# Altium schematic sheet Sheet4.SchDoc
size A3; DocumentNumber: 4; SheetNumber: 4; SheetTotal: 7
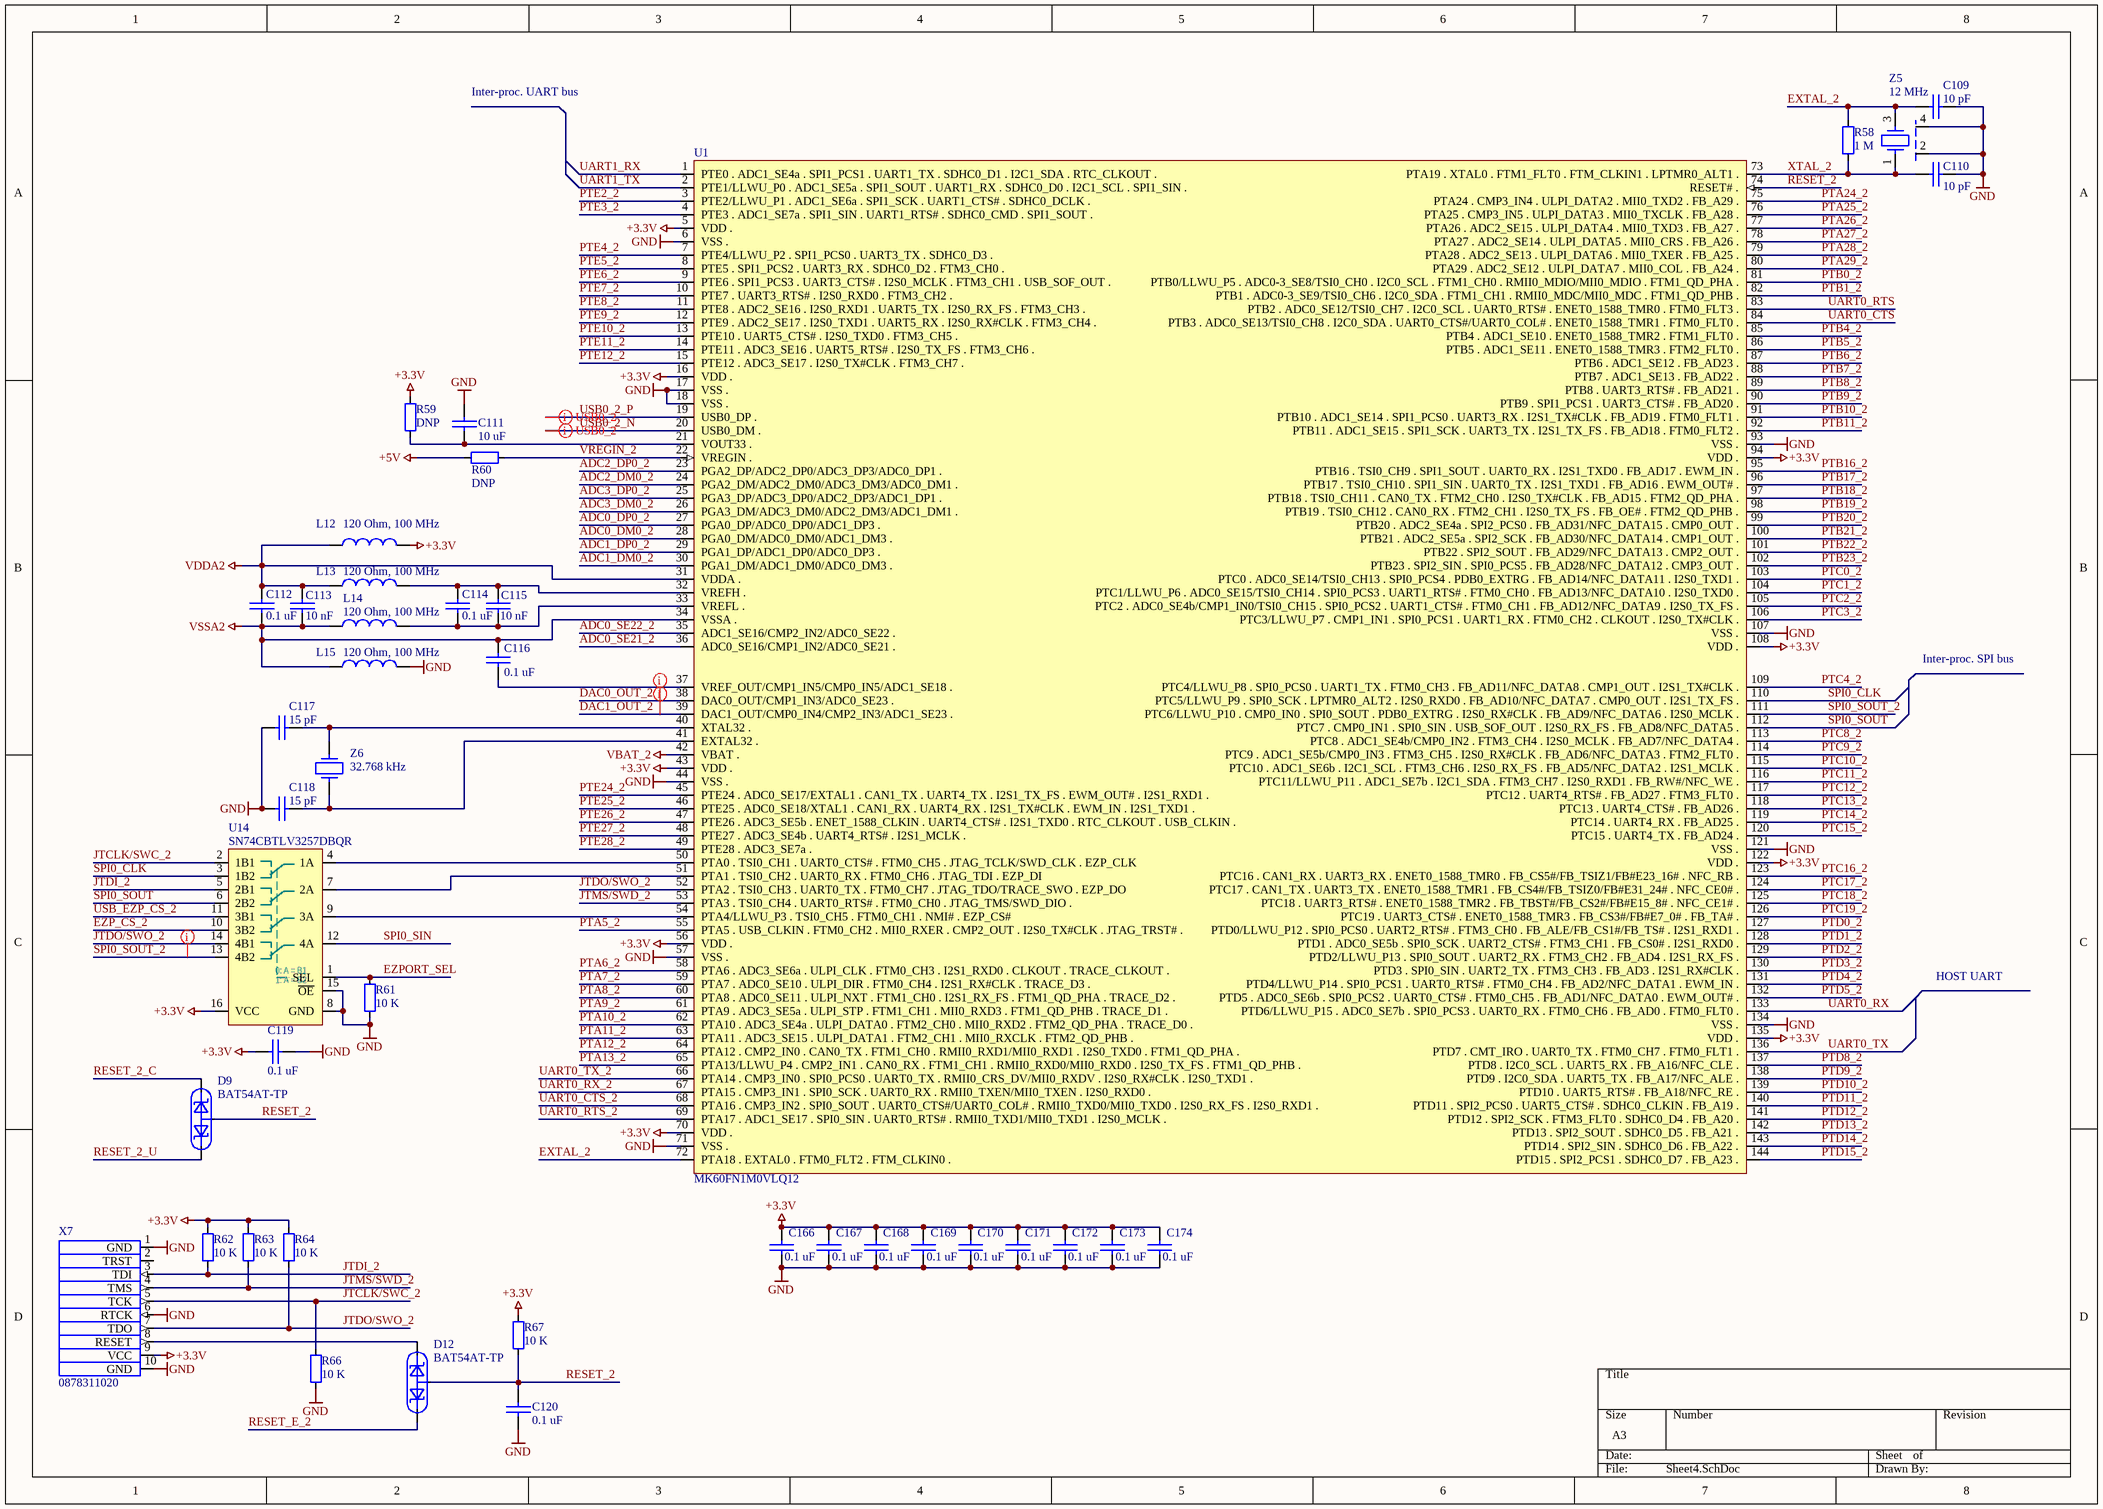
[diagram p0: Sheet4.SchDoc]

## Parts
C109  value 10 pF  [1608[0603]]  (hidden comment: CCPF010K0603)
C110  value 10 pF  [1608[0603]]  (hidden comment: CCPF010K0603)
C111  value 10 uF  [2012[0805]]  (hidden comment: C2012X5R1C106K085AC)
C112  value 0.1 uF  [1005[0402]]  (hidden comment: CL10B104KA8NNND)
C113  value 10 nF  [1005[0402]]  (hidden comment: CL05B103KB5NNNC)
C114  value 0.1 uF  [1005[0402]]  (hidden comment: CL10B104KA8NNND)
C115  value 10 nF  [1005[0402]]  (hidden comment: CL05B103KB5NNNC)
C116  value 0.1 uF  [1608[0603]]  (hidden comment: CL10B104KA8NNND)
C117  value 15 pF  [1608[0603]]  (hidden comment: CC0603JRNPO9BN150)
C118  value 15 pF  [1608[0603]]  (hidden comment: CC0603JRNPO9BN150)
C119  value 0.1 uF  [1005[0402]]  (hidden comment: CL10B104KA8NNND)
C120  value 0.1 uF  [1005[0402]]  (hidden comment: CL10B104KA8NNND)
C166  value 0.1 uF  [1005[0402]]  (hidden comment: CL10B104KA8NNND)
C167  value 0.1 uF  [1005[0402]]  (hidden comment: CL10B104KA8NNND)
C168  value 0.1 uF  [1005[0402]]  (hidden comment: CL10B104KA8NNND)
C169  value 0.1 uF  [1005[0402]]  (hidden comment: CL10B104KA8NNND)
C170  value 0.1 uF  [1005[0402]]  (hidden comment: CL10B104KA8NNND)
C171  value 0.1 uF  [1005[0402]]  (hidden comment: CL10B104KA8NNND)
C172  value 0.1 uF  [1005[0402]]  (hidden comment: CL10B104KA8NNND)
C173  value 0.1 uF  [1005[0402]]  (hidden comment: CL10B104KA8NNND)
C174  value 0.1 uF  [1005[0402]]  (hidden comment: CL10B104KA8NNND)
D9  BAT54AT-TP  [SOT-523F]
D12  BAT54AT-TP  [SOT-523F]
L12  value 120 Ohm, 100 MHz  [1005[0402]]  (hidden comment: MPZ1005S121C)
L13  value 120 Ohm, 100 MHz  [1005[0402]]  (hidden comment: MPZ1005S121C)
L14  value 120 Ohm, 100 MHz  [1005[0402]]  (hidden comment: MPZ1005S121C)
L15  value 120 Ohm, 100 MHz  [1005[0402]]  (hidden comment: MPZ1005S121C)
R58  value 1 M  [0603]  (hidden comment: RC0603FR-071ML)
R59  value DNP  [0603]  (hidden comment: DNP_0603)  (no BOM)
R60  value DNP  [0603]  (hidden comment: DNP_0603)  (no BOM)
R61  value 10 K  [0402]  (hidden comment: ERJ-3EKF1002V)
R62  value 10 K  [0402]  (hidden comment: ERJ-3EKF1002V)
R63  value 10 K  [0402]  (hidden comment: ERJ-3EKF1002V)
R64  value 10 K  [0402]  (hidden comment: ERJ-3EKF1002V)
R66  value 10 K  [0402]  (hidden comment: ERJ-3EKF1002V)
R67  value 10 K  [0402]  (hidden comment: ERJ-3EKF1002V)
U1  MK60FN1M0VLQ12  [LQFP144]
U14  SN74CBTLV3257DBQR  [TI DBQ 16pin (R-PDSO-G16)]
X7  0878311020  [878311020 MGRID WALL HDR SMD]
Z5  value 12 MHz  [DSX321G]  (hidden comment: NX3225SA-12.000MHZ-STD-CSR-1)
Z6  value 32.768 kHz  [ABS10]  (hidden comment: CM200C32768DZBT)

## Nets
+3.3V: C119.1 C166.2 C167.2 C168.2 C169.2 C170.2 C171.2 C172.2 C173.2 C174.2 L12.2 R59.1 R62.1 R63.1 R64.1 R67.1 U1.5(VDD_.) U1.16(VDD_.) U1.43(VDD_.) U1.56(VDD_.) U1.70(VDD_.) U1.94(VDD_.) U1.108(VDD_.) U1.122(VDD_.) U1.135(VDD_.) U14.16(VCC) X7.9(VCC)
+5V: R60.1
GND: C109.2 C110.2 C111.2 C117.2 C118.2 C119.2 C120.2 C166.1 C167.1 C168.1 C169.1 C170.1 C171.1 C172.1 C173.1 C174.1 L15.2 R61.2 R66.2 U1.6(VSS_.) U1.17(VSS_.) U1.18(VSS_.) U1.44(VSS_.) U1.57(VSS_.) U1.71(VSS_.) U1.93(VSS_.) U1.107(VSS_.) U1.121(VSS_.) U1.134(VSS_.) U14.8(GND) U14.15(~{OE}) X7.1(GND) X7.6(RTCK) X7.10(GND) Z5.2 Z5.4
VBAT_2: U1.42(VBAT_.)
VDDA2: C112.2 C113.1 L12.1 L13.1 U1.31(VDDA_.)
VSSA2: C112.1 C113.2 C116.2 L14.1 L15.1 U1.34(VSSA_.)
ADC0_DM0_2: U1.28(PGA0_DM/ADC0_DM0/ADC1_DM3_.)
ADC0_DP0_2: U1.27(PGA0_DP/ADC0_DP0/ADC1_DP3_.)
ADC0_SE21_2: U1.36(ADC0_SE16/CMP1_IN2/ADC0_SE21_.)
ADC0_SE22_2: U1.35(ADC1_SE16/CMP2_IN2/ADC0_SE22_.)
ADC1_DM0_2: U1.30(PGA1_DM/ADC1_DM0/ADC0_DM3_.)
ADC1_DP0_2: U1.29(PGA1_DP/ADC1_DP0/ADC0_DP3_.)
ADC2_DM0_2: U1.24(PGA2_DM/ADC2_DM0/ADC3_DM3/ADC0_DM1_.)
ADC2_DP0_2: U1.23(PGA2_DP/ADC2_DP0/ADC3_DP3/ADC0_DP1_.)
ADC3_DM0_2: U1.26(PGA3_DM/ADC3_DM0/ADC2_DM3/ADC1_DM1_.)
ADC3_DP0_2: U1.25(PGA3_DP/ADC3_DP0/ADC2_DP3/ADC1_DP1_.)
DAC0_OUT_2: U1.38(DAC0_OUT/CMP1_IN3/ADC0_SE23_.)
DAC1_OUT_2: U1.39(DAC1_OUT/CMP0_IN4/CMP2_IN3/ADC1_SE23_.)
EXTAL_2: C109.1 R58.2 U1.72(PTA18_._EXTAL0_._FTM0_FLT2_._FTM_CLKIN0_.) Z5.3
EZP_CS_2: U14.10(3B2)
EZPORT_SEL: R61.1 U14.1(SEL)
JTCLK/SWC_2: R66.1 U14.2(1B1) X7.5(TCK)
JTDI_2: R62.2 U14.5(2B1) X7.3(TDI)
JTDO/SWO_2: R64.2 U1.52(PTA2_._TSI0_CH3_._UART0_TX_._FTM0_CH7_._JTAG_TDO/TRACE_SWO_._EZP_DO) U14.14(4B1) X7.7(TDO)
JTMS/SWD_2: R63.2 U1.53(PTA3_._TSI0_CH4_._UART0_RTS#_._FTM0_CH0_._JTAG_TMS/SWD_DIO_.) X7.4(TMS)
PTA5_2: U1.55(PTA5_._USB_CLKIN_._FTM0_CH2_._MII0_RXER_._CMP2_OUT_._I2S0_TX#CLK_._JTAG_TRST#_.)
PTA6_2: U1.58(PTA6_._ADC3_SE6a_._ULPI_CLK_._FTM0_CH3_._I2S1_RXD0_._CLKOUT_._TRACE_CLKOUT_.)
PTA7_2: U1.59(PTA7_._ADC0_SE10_._ULPI_DIR_._FTM0_CH4_._I2S1_RX#CLK_._TRACE_D3_.)
PTA8_2: U1.60(PTA8_._ADC0_SE11_._ULPI_NXT_._FTM1_CH0_._I2S1_RX_FS_._FTM1_QD_PHA_._TRACE_D2_.)
PTA9_2: U1.61(PTA9_._ADC3_SE5a_._ULPI_STP_._FTM1_CH1_._MII0_RXD3_._FTM1_QD_PHB_._TRACE_D1_.)
PTA10_2: U1.62(PTA10_._ADC3_SE4a_._ULPI_DATA0_._FTM2_CH0_._MII0_RXD2_._FTM2_QD_PHA_._TRACE_D0_.)
PTA11_2: U1.63(PTA11_._ADC3_SE15_._ULPI_DATA1_._FTM2_CH1_._MII0_RXCLK_._FTM2_QD_PHB_.)
PTA12_2: U1.64(PTA12_._CMP2_IN0_._CAN0_TX_._FTM1_CH0_._RMII0_RXD1/MII0_RXD1_._I2S0_TXD0_._FTM1_QD_PHA_.)
PTA13_2: U1.65(PTA13/LLWU_P4_._CMP2_IN1_._CAN0_RX_._FTM1_CH1_._RMII0_RXD0/MII0_RXD0_._I2S0_TX_FS_._FTM1_QD_PHB_.)
PTA24_2: U1.75(PTA24_._CMP3_IN4_._ULPI_DATA2_._MII0_TXD2_._FB_A29_.)
PTA25_2: U1.76(PTA25_._CMP3_IN5_._ULPI_DATA3_._MII0_TXCLK_._FB_A28_.)
PTA26_2: U1.77(PTA26_._ADC2_SE15_._ULPI_DATA4_._MII0_TXD3_._FB_A27_.)
PTA27_2: U1.78(PTA27_._ADC2_SE14_._ULPI_DATA5_._MII0_CRS_._FB_A26_.)
PTA28_2: U1.79(PTA28_._ADC2_SE13_._ULPI_DATA6_._MII0_TXER_._FB_A25_.)
PTA29_2: U1.80(PTA29_._ADC2_SE12_._ULPI_DATA7_._MII0_COL_._FB_A24_.)
PTB0_2: U1.81(PTB0/LLWU_P5_._ADC0-3_SE8/TSI0_CH0_._I2C0_SCL_._FTM1_CH0_._RMII0_MDIO/MII0_MDIO_._FTM1_QD_PHA_.)
PTB1_2: U1.82(PTB1_._ADC0-3_SE9/TSI0_CH6_._I2C0_SDA_._FTM1_CH1_._RMII0_MDC/MII0_MDC_._FTM1_QD_PHB_.)
PTB4_2: U1.85(PTB4_._ADC1_SE10_._ENET0_1588_TMR2_._FTM1_FLT0_.)
PTB5_2: U1.86(PTB5_._ADC1_SE11_._ENET0_1588_TMR3_._FTM2_FLT0_.)
PTB6_2: U1.87(PTB6_._ADC1_SE12_._FB_AD23_.)
PTB7_2: U1.88(PTB7_._ADC1_SE13_._FB_AD22_.)
PTB8_2: U1.89(PTB8_._UART3_RTS#_._FB_AD21_.)
PTB9_2: U1.90(PTB9_._SPI1_PCS1_._UART3_CTS#_._FB_AD20_.)
PTB10_2: U1.91(PTB10_._ADC1_SE14_._SPI1_PCS0_._UART3_RX_._I2S1_TX#CLK_._FB_AD19_._FTM0_FLT1_.)
PTB11_2: U1.92(PTB11_._ADC1_SE15_._SPI1_SCK_._UART3_TX_._I2S1_TX_FS_._FB_AD18_._FTM0_FLT2_.)
PTB16_2: U1.95(PTB16_._TSI0_CH9_._SPI1_SOUT_._UART0_RX_._I2S1_TXD0_._FB_AD17_._EWM_IN_.)
PTB17_2: U1.96(PTB17_._TSI0_CH10_._SPI1_SIN_._UART0_TX_._I2S1_TXD1_._FB_AD16_._EWM_OUT#_.)
PTB18_2: U1.97(PTB18_._TSI0_CH11_._CAN0_TX_._FTM2_CH0_._I2S0_TX#CLK_._FB_AD15_._FTM2_QD_PHA_.)
PTB19_2: U1.98(PTB19_._TSI0_CH12_._CAN0_RX_._FTM2_CH1_._I2S0_TX_FS_._FB_OE#_._FTM2_QD_PHB_.)
PTB20_2: U1.99(PTB20_._ADC2_SE4a_._SPI2_PCS0_._FB_AD31/NFC_DATA15_._CMP0_OUT_.)
PTB21_2: U1.100(PTB21_._ADC2_SE5a_._SPI2_SCK_._FB_AD30/NFC_DATA14_._CMP1_OUT_.)
PTB22_2: U1.101(PTB22_._SPI2_SOUT_._FB_AD29/NFC_DATA13_._CMP2_OUT_.)
PTB23_2: U1.102(PTB23_._SPI2_SIN_._SPI0_PCS5_._FB_AD28/NFC_DATA12_._CMP3_OUT_.)
PTC0_2: U1.103(PTC0_._ADC0_SE14/TSI0_CH13_._SPI0_PCS4_._PDB0_EXTRG_._FB_AD14/NFC_DATA11_._I2S0_TXD1_.)
PTC1_2: U1.104(PTC1/LLWU_P6_._ADC0_SE15/TSI0_CH14_._SPI0_PCS3_._UART1_RTS#_._FTM0_CH0_._FB_AD13/NFC_DATA10_._I2S0_TXD0_.)
PTC2_2: U1.105(PTC2_._ADC0_SE4b/CMP1_IN0/TSI0_CH15_._SPI0_PCS2_._UART1_CTS#_._FTM0_CH1_._FB_AD12/NFC_DATA9_._I2S0_TX_FS_.)
PTC3_2: U1.106(PTC3/LLWU_P7_._CMP1_IN1_._SPI0_PCS1_._UART1_RX_._FTM0_CH2_._CLKOUT_._I2S0_TX#CLK_.)
PTC4_2: U1.109(PTC4/LLWU_P8_._SPI0_PCS0_._UART1_TX_._FTM0_CH3_._FB_AD11/NFC_DATA8_._CMP1_OUT_._I2S1_TX#CLK_.)
PTC8_2: U1.113(PTC8_._ADC1_SE4b/CMP0_IN2_._FTM3_CH4_._I2S0_MCLK_._FB_AD7/NFC_DATA4_.)
PTC9_2: U1.114(PTC9_._ADC1_SE5b/CMP0_IN3_._FTM3_CH5_._I2S0_RX#CLK_._FB_AD6/NFC_DATA3_._FTM2_FLT0_.)
PTC10_2: U1.115(PTC10_._ADC1_SE6b_._I2C1_SCL_._FTM3_CH6_._I2S0_RX_FS_._FB_AD5/NFC_DATA2_._I2S1_MCLK_.)
PTC11_2: U1.116(PTC11/LLWU_P11_._ADC1_SE7b_._I2C1_SDA_._FTM3_CH7_._I2S0_RXD1_._FB_RW#/NFC_WE_.)
PTC12_2: U1.117(PTC12_._UART4_RTS#_._FB_AD27_._FTM3_FLT0_.)
PTC13_2: U1.118(PTC13_._UART4_CTS#_._FB_AD26_.)
PTC14_2: U1.119(PTC14_._UART4_RX_._FB_AD25_.)
PTC15_2: U1.120(PTC15_._UART4_TX_._FB_AD24_.)
PTC16_2: U1.123(PTC16_._CAN1_RX_._UART3_RX_._ENET0_1588_TMR0_._FB_CS5#/FB_TSIZ1/FB#E23_16#_._NFC_RB_.)
PTC17_2: U1.124(PTC17_._CAN1_TX_._UART3_TX_._ENET0_1588_TMR1_._FB_CS4#/FB_TSIZ0/FB#E31_24#_._NFC_CE0#_.)
PTC18_2: U1.125(PTC18_._UART3_RTS#_._ENET0_1588_TMR2_._FB_TBST#/FB_CS2#/FB#E15_8#_._NFC_CE1#_.)
PTC19_2: U1.126(PTC19_._UART3_CTS#_._ENET0_1588_TMR3_._FB_CS3#/FB#E7_0#_._FB_TA#_.)
PTD0_2: U1.127(PTD0/LLWU_P12_._SPI0_PCS0_._UART2_RTS#_._FTM3_CH0_._FB_ALE/FB_CS1#/FB_TS#_._I2S1_RXD1_.)
PTD1_2: U1.128(PTD1_._ADC0_SE5b_._SPI0_SCK_._UART2_CTS#_._FTM3_CH1_._FB_CS0#_._I2S1_RXD0_.)
PTD2_2: U1.129(PTD2/LLWU_P13_._SPI0_SOUT_._UART2_RX_._FTM3_CH2_._FB_AD4_._I2S1_RX_FS_.)
PTD3_2: U1.130(PTD3_._SPI0_SIN_._UART2_TX_._FTM3_CH3_._FB_AD3_._I2S1_RX#CLK_.)
PTD4_2: U1.131(PTD4/LLWU_P14_._SPI0_PCS1_._UART0_RTS#_._FTM0_CH4_._FB_AD2/NFC_DATA1_._EWM_IN_.)
PTD5_2: U1.132(PTD5_._ADC0_SE6b_._SPI0_PCS2_._UART0_CTS#_._FTM0_CH5_._FB_AD1/NFC_DATA0_._EWM_OUT#_.)
PTD8_2: U1.137(PTD8_._I2C0_SCL_._UART5_RX_._FB_A16/NFC_CLE_.)
PTD9_2: U1.138(PTD9_._I2C0_SDA_._UART5_TX_._FB_A17/NFC_ALE_.)
PTD10_2: U1.139(PTD10_._UART5_RTS#_._FB_A18/NFC_RE_.)
PTD11_2: U1.140(PTD11_._SPI2_PCS0_._UART5_CTS#_._SDHC0_CLKIN_._FB_A19_.)
PTD12_2: U1.141(PTD12_._SPI2_SCK_._FTM3_FLT0_._SDHC0_D4_._FB_A20_.)
PTD13_2: U1.142(PTD13_._SPI2_SOUT_._SDHC0_D5_._FB_A21_.)
PTD14_2: U1.143(PTD14_._SPI2_SIN_._SDHC0_D6_._FB_A22_.)
PTD15_2: U1.144(PTD15_._SPI2_PCS1_._SDHC0_D7_._FB_A23_.)
PTE2_2: U1.3(PTE2/LLWU_P1_._ADC1_SE6a_._SPI1_SCK_._UART1_CTS#_._SDHC0_DCLK_.)
PTE3_2: U1.4(PTE3_._ADC1_SE7a_._SPI1_SIN_._UART1_RTS#_._SDHC0_CMD_._SPI1_SOUT_.)
PTE4_2: U1.7(PTE4/LLWU_P2_._SPI1_PCS0_._UART3_TX_._SDHC0_D3_.)
PTE5_2: U1.8(PTE5_._SPI1_PCS2_._UART3_RX_._SDHC0_D2_._FTM3_CH0_.)
PTE6_2: U1.9(PTE6_._SPI1_PCS3_._UART3_CTS#_._I2S0_MCLK_._FTM3_CH1_._USB_SOF_OUT_.)
PTE7_2: U1.10(PTE7_._UART3_RTS#_._I2S0_RXD0_._FTM3_CH2_.)
PTE8_2: U1.11(PTE8_._ADC2_SE16_._I2S0_RXD1_._UART5_TX_._I2S0_RX_FS_._FTM3_CH3_.)
PTE9_2: U1.12(PTE9_._ADC2_SE17_._I2S0_TXD1_._UART5_RX_._I2S0_RX#CLK_._FTM3_CH4_.)
PTE10_2: U1.13(PTE10_._UART5_CTS#_._I2S0_TXD0_._FTM3_CH5_.)
PTE11_2: U1.14(PTE11_._ADC3_SE16_._UART5_RTS#_._I2S0_TX_FS_._FTM3_CH6_.)
PTE12_2: U1.15(PTE12_._ADC3_SE17_._I2S0_TX#CLK_._FTM3_CH7_.)
PTE24_2: U1.45(PTE24_._ADC0_SE17/EXTAL1_._CAN1_TX_._UART4_TX_._I2S1_TX_FS_._EWM_OUT#_._I2S1_RXD1_.)
PTE25_2: U1.46(PTE25_._ADC0_SE18/XTAL1_._CAN1_RX_._UART4_RX_._I2S1_TX#CLK_._EWM_IN_._I2S1_TXD1_.)
PTE26_2: U1.47(PTE26_._ADC3_SE5b_._ENET_1588_CLKIN_._UART4_CTS#_._I2S1_TXD0_._RTC_CLKOUT_._USB_CLKIN_.)
PTE27_2: U1.48(PTE27_._ADC3_SE4b_._UART4_RTS#_._I2S1_MCLK_.)
PTE28_2: U1.49(PTE28_._ADC3_SE7a_.)
RESET_2: C120.1 D9.3 D12.3 R67.2 U1.74(RESET#_.)
RESET_2_C: D9.1
RESET_2_U: D9.2
RESET_E_2: D12.2
SPI0_CLK: U1.110(PTC5/LLWU_P9_._SPI0_SCK_._LPTMR0_ALT2_._I2S0_RXD0_._FB_AD10/NFC_DATA7_._CMP0_OUT_._I2S1_TX_FS_.) U14.3(1B2)
SPI0_SIN: U14.12(4A)
SPI0_SOUT: U1.112(PTC7_._CMP0_IN1_._SPI0_SIN_._USB_SOF_OUT_._I2S0_RX_FS_._FB_AD8/NFC_DATA5_.) U14.6(2B2)
SPI0_SOUT_2: U1.111(PTC6/LLWU_P10_._CMP0_IN0_._SPI0_SOUT_._PDB0_EXTRG_._I2S0_RX#CLK_._FB_AD9/NFC_DATA6_._I2S0_MCLK_.) U14.13(4B2)
UART0_CTS: U1.84(PTB3_._ADC0_SE13/TSI0_CH8_._I2C0_SDA_._UART0_CTS#/UART0_COL#_._ENET0_1588_TMR1_._FTM0_FLT0_.)
UART0_CTS_2: U1.68(PTA16_._CMP3_IN2_._SPI0_SOUT_._UART0_CTS#/UART0_COL#_._RMII0_TXD0/MII0_TXD0_._I2S0_RX_FS_._I2S0_RXD1_.)
UART0_RTS: U1.83(PTB2_._ADC0_SE12/TSI0_CH7_._I2C0_SCL_._UART0_RTS#_._ENET0_1588_TMR0_._FTM0_FLT3_.)
UART0_RTS_2: U1.69(PTA17_._ADC1_SE17_._SPI0_SIN_._UART0_RTS#_._RMII0_TXD1/MII0_TXD1_._I2S0_MCLK_.)
UART0_RX: U1.133(PTD6/LLWU_P15_._ADC0_SE7b_._SPI0_PCS3_._UART0_RX_._FTM0_CH6_._FB_AD0_._FTM0_FLT0_.)
UART0_RX_2: U1.67(PTA15_._CMP3_IN1_._SPI0_SCK_._UART0_RX_._RMII0_TXEN/MII0_TXEN_._I2S0_RXD0_.)
UART0_TX: U1.136(PTD7_._CMT_IRO_._UART0_TX_._FTM0_CH7_._FTM0_FLT1_.)
UART0_TX_2: U1.66(PTA14_._CMP3_IN0_._SPI0_PCS0_._UART0_TX_._RMII0_CRS_DV/MII0_RXDV_._I2S0_RX#CLK_._I2S0_TXD1_.)
UART1_RX: U1.1(PTE0_._ADC1_SE4a_._SPI1_PCS1_._UART1_TX_._SDHC0_D1_._I2C1_SDA_._RTC_CLKOUT_.)
UART1_TX: U1.2(PTE1/LLWU_P0_._ADC1_SE5a_._SPI1_SOUT_._UART1_RX_._SDHC0_D0_._I2C1_SCL_._SPI1_SIN_.)
USB0_2_N: U1.20(USB0_DM_.)
USB0_2_P: U1.19(USB0_DP_.)
USB_EZP_CS_2: U14.11(3B1)
VREGIN_2: R60.2 U1.22(VREGIN_.)
XTAL_2: C110.1 R58.1 U1.73(PTA19_._XTAL0_._FTM1_FLT0_._FTM_CLKIN1_._LPTMR0_ALT1_.) Z5.1
NetC111_1: C111.1 R59.2 U1.21(VOUT33_.)
NetC114_1: C114.1 C115.2 L14.2 U1.33(VREFL_.)
NetC114_2: C114.2 C115.1 L13.2 U1.32(VREFH_.)
NetC116_1: C116.1 U1.37(VREF_OUT/CMP1_IN5/CMP0_IN5/ADC1_SE18_.)
NetC117_1: C117.1 U1.40(XTAL32_.) Z6.1
NetC118_1: C118.1 U1.41(EXTAL32_.) Z6.2
NetD12_1: D12.1 X7.8(RESET)
NetU1_50: U1.50(PTA0_._TSI0_CH1_._UART0_CTS#_._FTM0_CH5_._JTAG_TCLK/SWD_CLK_._EZP_CLK) U14.4(1A)
NetU1_51: U1.51(PTA1_._TSI0_CH2_._UART0_RX_._FTM0_CH6_._JTAG_TDI_._EZP_DI) U14.7(2A)
NetU1_54: U1.54(PTA4/LLWU_P3_._TSI0_CH5_._FTM0_CH1_._NMI#_._EZP_CS#) U14.9(3A)

Not connected (* = marked no-connect by the designer): X7 2(TRST)

## Layout directives
net class ANALOG2: DAC0_OUT_2, DAC1_OUT_2
net class IPC_SPI: SPI0_SOUT_2
differential pair: USB0_2_N, USB0_2_P

## Notes on the sheet
- Inter-proc. UART bus
- Inter-proc. SPI bus
- HOST UART
- (in symbol SN74CBTLV3257DBQR) 0: A = B1; 1: A = B2

## Library data of the parts
C109 C110 = CCPF010K0603: 10 pF, 50V, 5%, NP0, 0603 SMD MLC Capacitor; Manufacturer: Kemet; PartNum: 399-1049-1-ND; PartName: C0603C100J5GACTU; Tolerance: 5%; Price: 0.0075$; Distributor: Digi-Key; Voltage: 50 V
C111 = C2012X5R1C106K/0.85: 10 uF, 16V, X5R, ±10%, 0805; Manufacturer: TDK Corporation; Distributor: Future; Price: 0.0347 Euro; Tolerance: ±10%; PartNum: C2012X5R1C106K085AC; Voltage: 16V; PartName: C2012X5R1C106K085AC; Price50: 0.0347 Euro; Price100: 0.0347 Euro; Price1000: 0.0347 Euro
C112 C114 C119 C120 C166-C174 = GRM155R71C104KA88D: 0.1 uF, 16V, 10%, X7R, 0402; Manufacturer: Murata; PartNum: 490-3261-1-ND; Tolerance: 10%; Distributor: Digi-Key; Price: 0.005$; Voltage: 16 V
C113 C115 = GRM155R71C103KA01D_1: 10 nF, 16V, 10%, X7R, 0402; Manufacturer: SAMSUNG; Tolerance: 10%; Distributor: Future; Price: 0.02$; PartNum: CL05B103KB5NNNC; Voltage: 16 V; PartName: CL05B103KB5NNNC
C116 = CVNF100K0603-25: 0.1 uF, 25V, 10% , X7R,  0603 SMD MLC Capacitor; Manufacturer: SAMSUNG; Tolerance: 10%; Distributor: Future; Price: 0.0026 Euro; Voltage: 25 V; PartNum: CL10B104KA8NNND; PartName: CL10B104KA8NNND; Price50: 0.0026 Euro; Price100: 0.0026 Euro; Price1000: 0.0026 Euro
C117 C118 = CCPF015K0603: 15 pF, 50V, 5%, NP0, 0603 SMD MLC Capacitor; Manufacturer: YAGEO AMERICA CORPORATION; Tolerance: 5%; Price: 0.003$; Distributor: Future; PartNum: CC0603JRNPO9BN150; Voltage: 50 V; PartName: CC0603JRNPO9BN150; Price50: 0.003$; Price100: 0.003$; Price1000: 0.003$
D9 D12 = BAT54AT-TP: Schottky Diode, 30 V, 200 mA, common anode, SOT523; Manufacturer: Micro Commercial Co; PartNum: BAT54AT-TPDKR-ND; Distributor: Digi-Key; Price: 0.52$; PartName: BAT54AT-TP
L12-L15 = MPZ1005S121C: Ferrite bead, 120 Ohm, 100 MHz,  1.2 A, 0.09 Ohm, 0402; Manufacturer: TDK Corporation; PartNum: 445-2981-1-ND; Distributor: Digi-Key; Price: 0.1$; PartName: MPZ1005S121C
R58 = RC0603FR-071ML: 1 M, 1%, 0603, SMD Resistor, Taped; Manufacturer: YAGEO AMERICA CORPORATION; Voltage: 75 V; Distributor: Future; Price: 0.002 Euro; Tolerance: 1%; PartNum: RC0603FR-071ML; PartName: RC0603FR-071ML
R59 R60 = DNP_0603: DNP, 0603
R61-R64 R66 R67 = RC0402JR-0710KL: 10 K, 5%, 0402, SMD Resistor, Taped; Manufacturer: Yageo; PartNum: 311-10KJRCT-ND; Voltage: 75 V; Distributor: Digi-Key; Price: 0.1$; Tolerance: 5%; PartName: RC0402JR-0710KL
U1 = MK60FN1M0VLQ12: MK60 Series 32 Bit 1 MB Flash 128 KB Ram 120 Mhz Microcontroller - LQFP-144; Manufacturer: Freescale; Distributor: Future; PartNum: MK60FN1M0VLQ12; Price: 8.45 Euro
U14 = SN74CBTLV3257DBQR: LV DUAL FET MUX/DEMUX, 2.3..3.6V,  -40..85 C, 16SSOP; Manufacturer: Texas Instruments; PartNum: 296-9135-1-ND; Price: 0.95$; Distributor: Digi-Key; PartName: SN74CBTLV3257DBQR
X7 = 0878321020: JTAG, CONN HEADER 10POS 2MM VERT SMD; Manufacturer: Molex Inc; PartNum: WM18639-ND; Distributor: Digi-Key; Price: 1.29$; PartName: 0878321020
Z5 = NX3225SA-12.000MHZ-STD-CSR-1: 12 MHz, 8 pF, ±15ppm, -10...+75 С; Manufacturer: NDK; PartNum: 644-1047-1-ND; Price: 1$; Distributor: Digi-Key; Tolerance: 15 ppm; PartName: NX3225SA-12.000MHZ-STD-CSR-1
Z6 = ABS10-32.768KHZ-T: 32.768 kHz, 12.5 pF, 70 kOhm, ±20ppm, -40°C ~ 80°C; Manufacturer: Abracon Corporation; PartNum: 535-9536-1-ND; Price: 0.82$; Tolerance: 20 ppm; Distributor: Digi-Key; PartName: ABS10-32.768KHZ-T